# EasyEDA Pro project RemlaHAT.epro

# Schematic Atomic Spectra

## Sheets
1 Motors and Ambient Light: Create Date: 2024-02-16; Page Name: Motors and Ambient Light; Project Name: RemlaHAT; Schematic Name: Atomic Spectra; Update Date: 2024-02-16; Company: UCSB Physics Remla; Drawed: Barry Wang; Page Size: A4; Version: V0.1
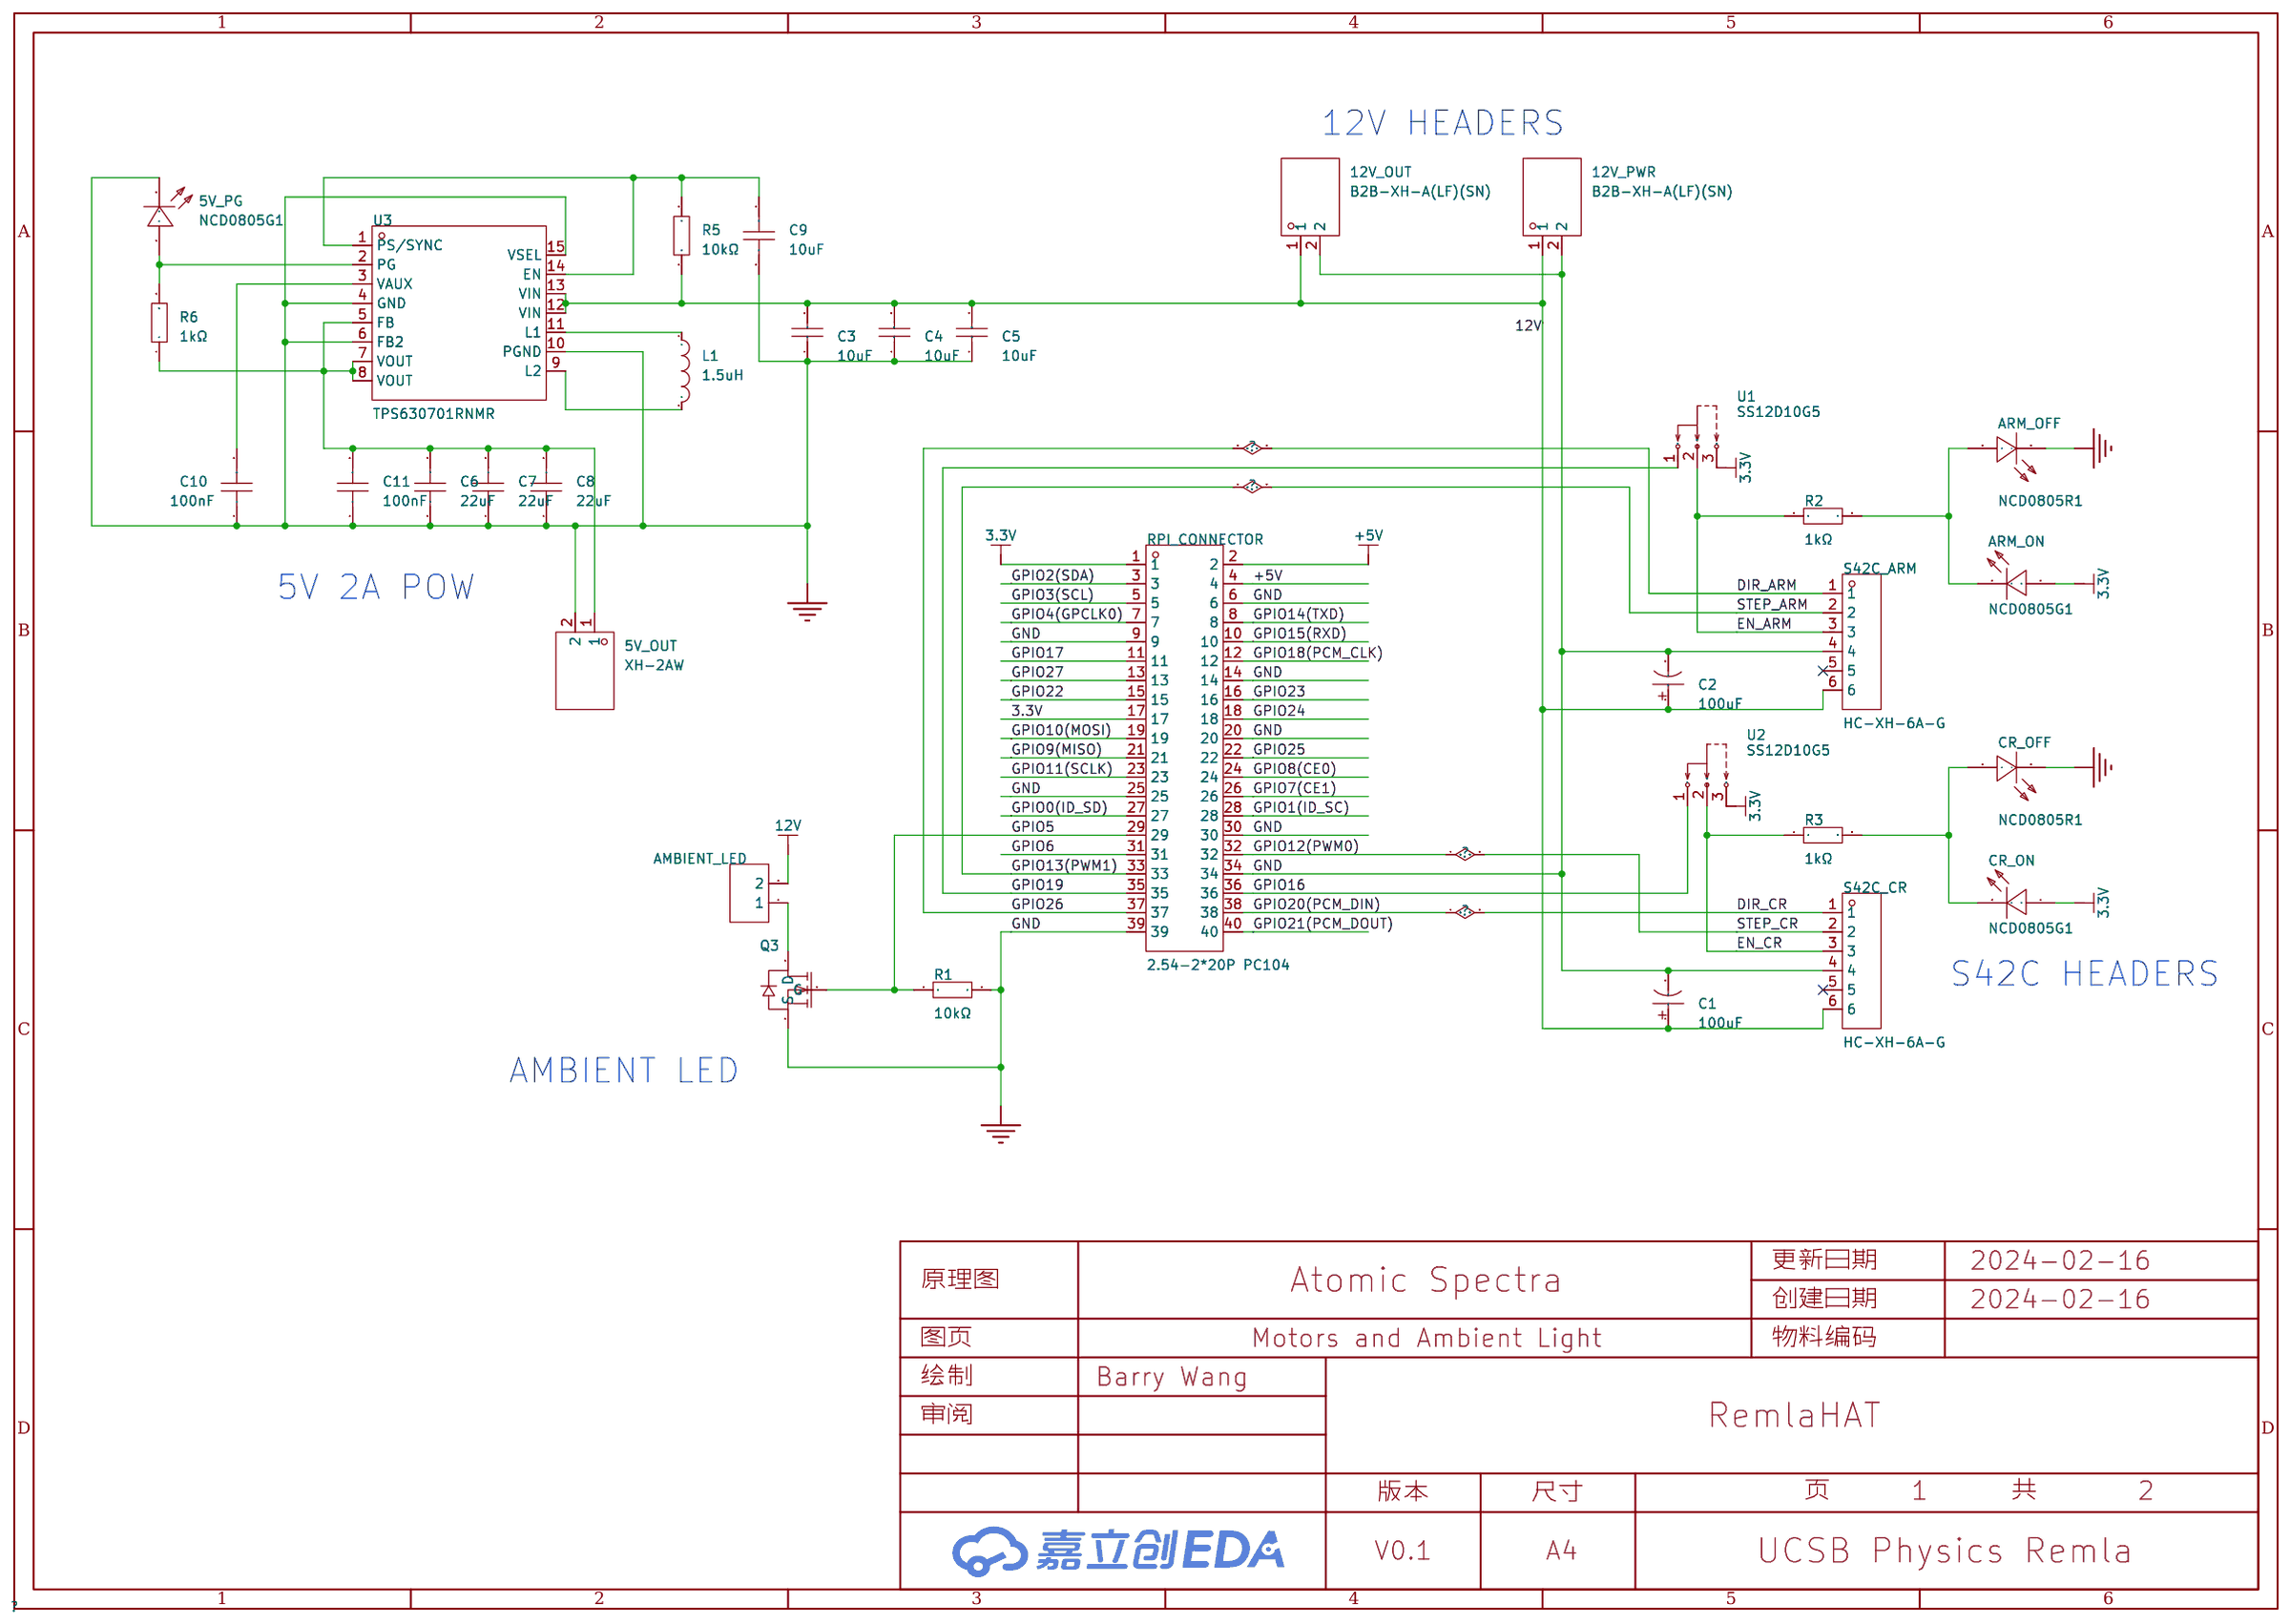
[diagram p0: Motors and Ambient Light]
2 Camera Connector: Page Name: Camera Connector; Company: 嘉立创EDA; Version: V1.0
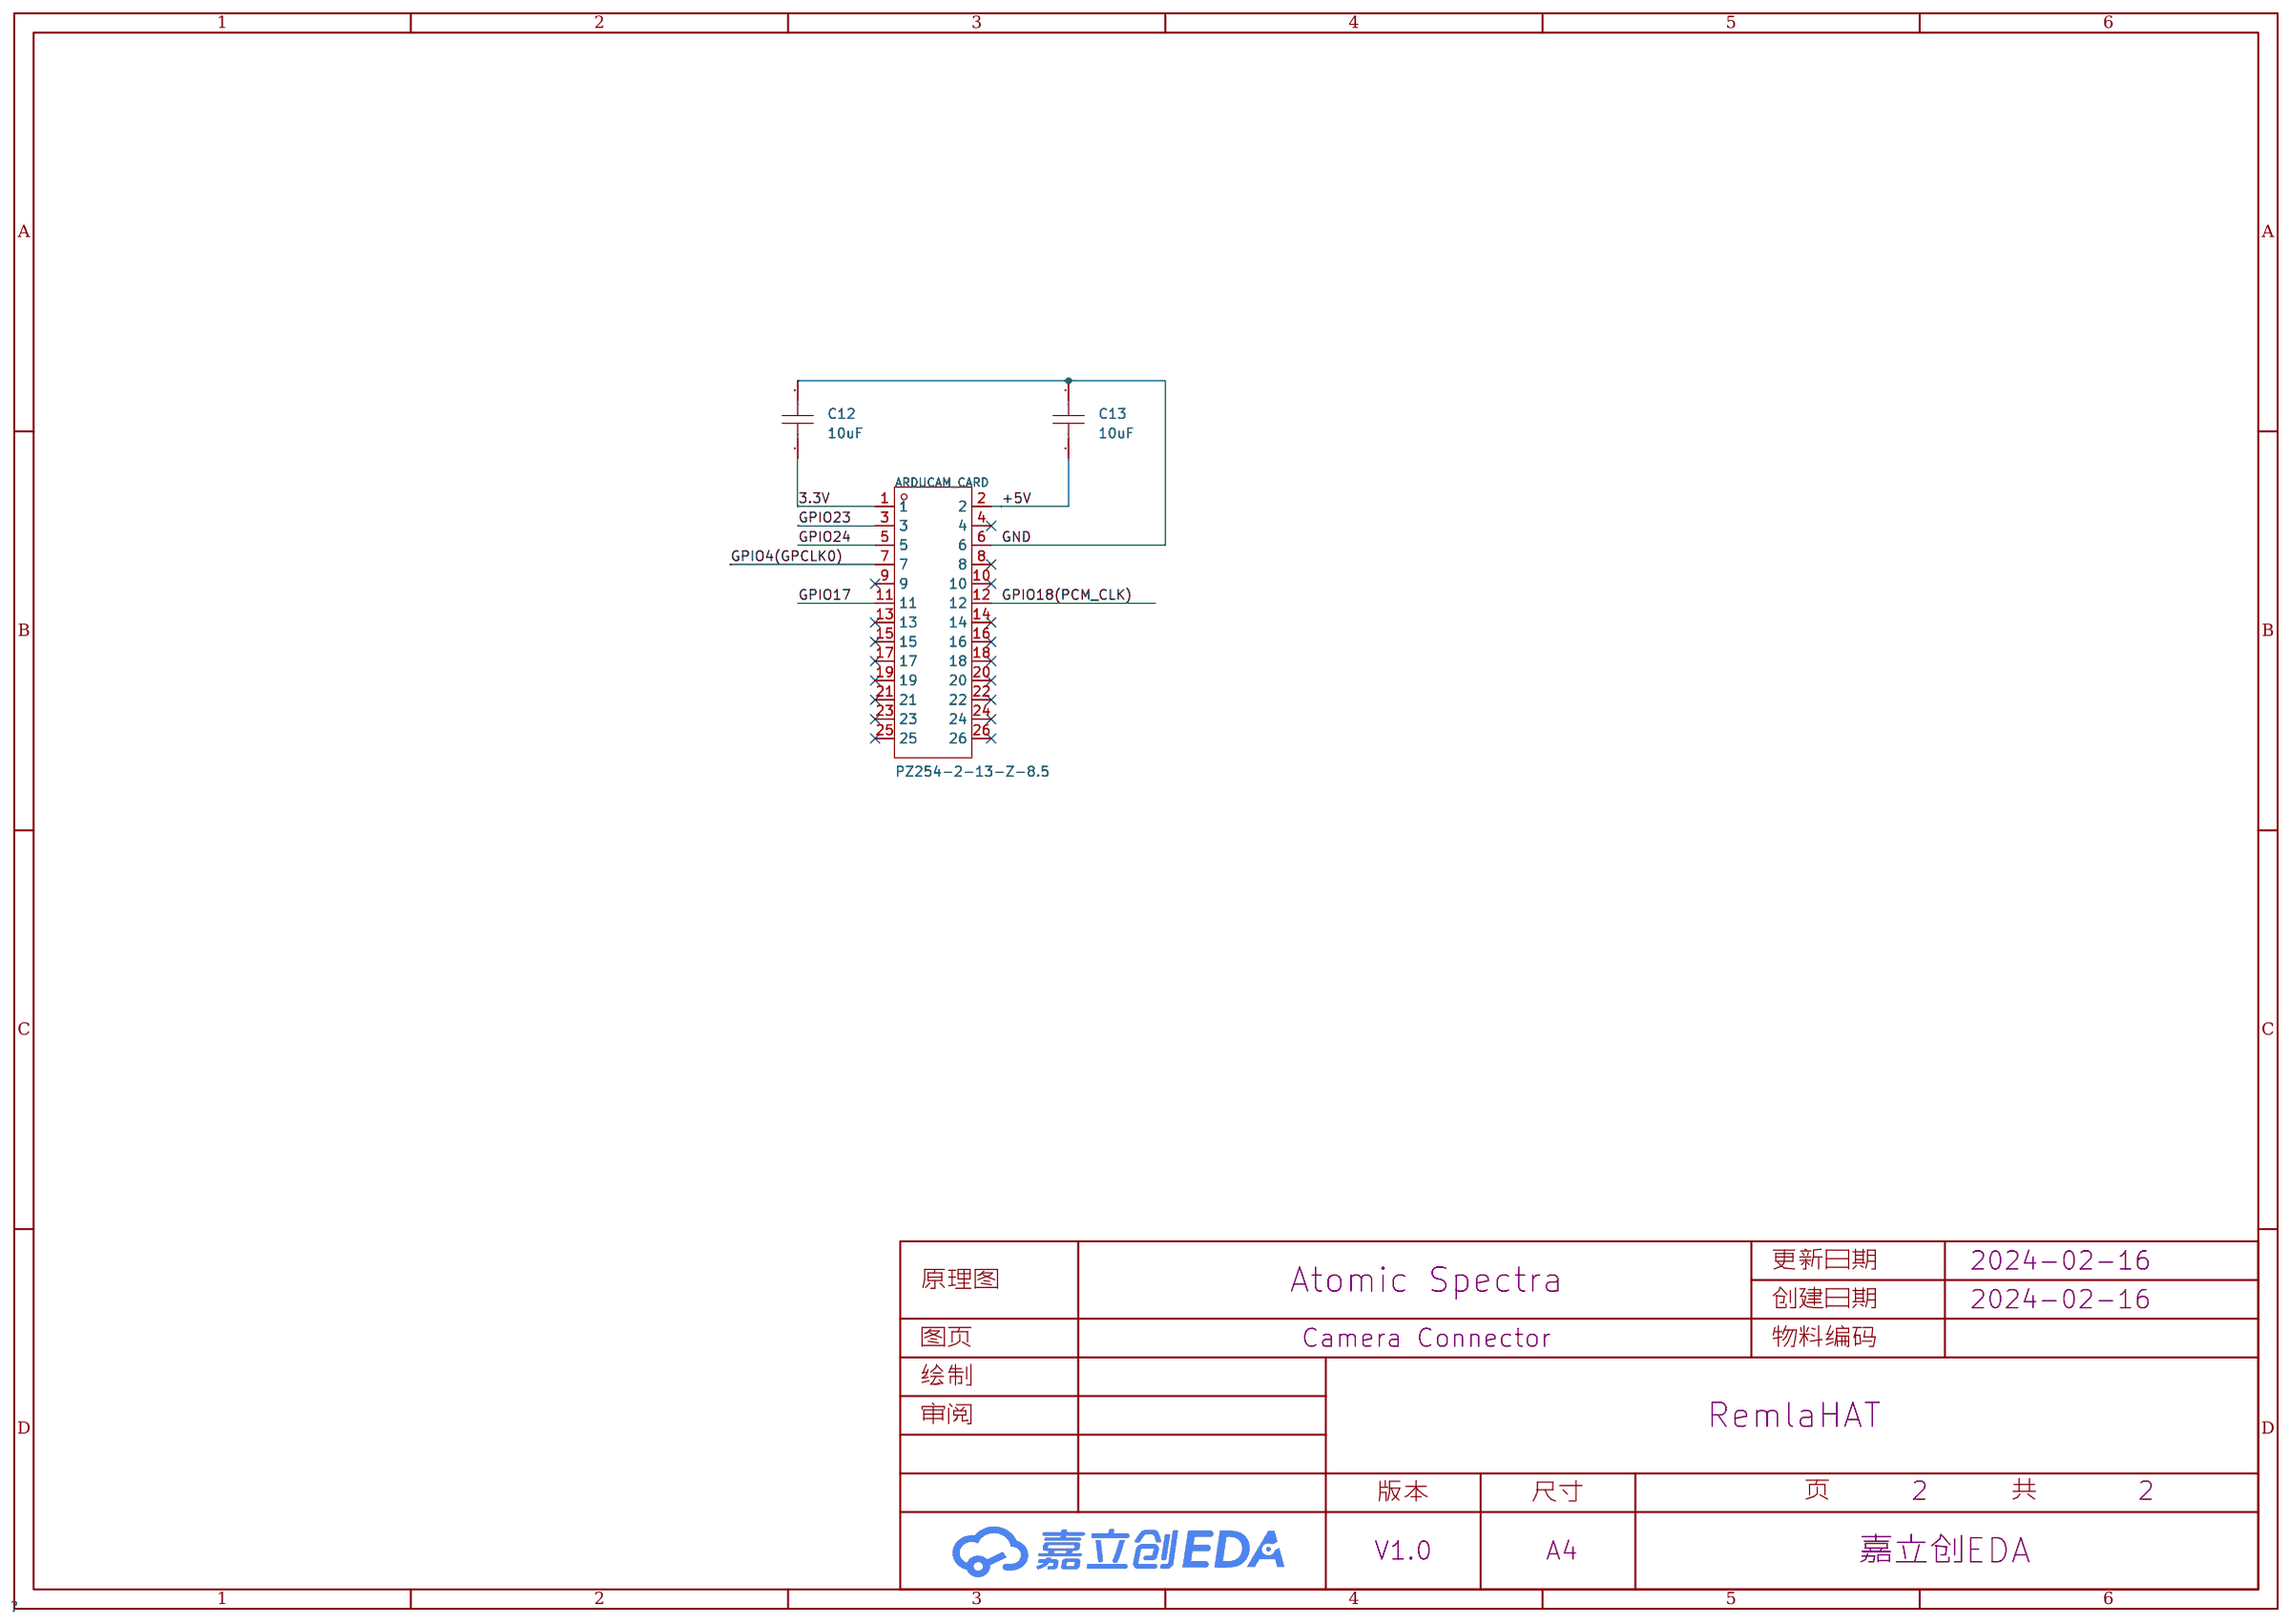
[diagram p1: Camera Connector]

## Parts
sheet Camera Connector
ARDUCAM_CARD  PZ254-2-13-Z-8.5  [HDR-TH_26P-P2.54-V-M-R2-C13-S2.54]
C12  10uF  [C0603]
C13  10uF  [C0603]
sheet Motors and Ambient Light
5V_OUT  XH-2AW  [CONN-TH_2P-P2.50_XH-2AW]
5V_PG  NCD0805G1  [LED0805-R-RD]
12V_OUT  B2B-XH-A(LF)(SN)  [CONN-TH_B2B-XH-A-LF-SN]
12V_PWR  B2B-XH-A(LF)(SN)  [CONN-TH_B2B-XH-A-LF-SN]
AMBIENT_LED  -  [HDR-TH_2P-P2.54-V-F]
ARM_OFF  NCD0805R1  [LED0805-R-RD]
ARM_ON  NCD0805G1  [LED0805-R-RD]
C1  100uF  [CAP-TH_BD5.0-P2.00-D0.8-FD]
C2  100uF  [CAP-TH_BD5.0-P2.00-D0.8-FD]
C3  10uF  [C0805]
C4  10uF  [C0805]
C5  10uF  [C0805]
C6  22uF  [C0805]
C7  22uF  [C0805]
C8  22uF  [C0805]
C9  10uF  [C0603]
C10  100nF  [C0402]
C11  100nF  [C0603]
CR_OFF  NCD0805R1  [LED0805-R-RD]
CR_ON  NCD0805G1  [LED0805-R-RD]
L1  1.5uH  [IND-SMD_L4.0-W4.0-A]
Q3  -  [SOT-23-3_L2.9-W1.3-P1.90-LS2.4-BR]
R1  10kΩ  [R0603]
R2  1kΩ  [R0603]
R3  1kΩ  [R0603]
R5  10kΩ  [R0603]
R6  1kΩ  [R0603]
RPI_CONNECTOR  2.54-2*20P PC104  [HDR-TH_40P-P2.54-V-F-R2-C20-S2.54-2]  (no BOM)
S42C_ARM  HC-XH-6A-G  [CONN-TH_6P-P2.50_HC-XH-6A-G]
S42C_CR  HC-XH-6A-G  [CONN-TH_6P-P2.50_HC-XH-6A-G]
U1  SS12D10G5  [SW-TH_SHOU-HAN_SS12D10G4]
U2  SS12D10G5  [SW-TH_SHOU-HAN_SS12D10G4]
U3  TPS630701RNMR  [VQFN-HR-15_L3.0-W2.5-P0.50-BL_TPS63070RNMR]

## Library data of the parts
ARDUCAM_CARD = PZ254-2-13-Z-8.5: 排数:双排;总PIN位数:26P;间距:2.54mm;插针结构:2x13P;行距:2.54mm;安装类型:直插;圆针/方针:方针;额定电流:3A;额定电压:-;配合针长度:6mm;塑高:2.5mm;端接针长度:3mm;触头材质:-;工作温度范围:-40℃~+105℃;颜色:黑色;; LCSC Part Name: 2.54mm 2x13P 直插 方针; Supplier Part: C2894974; Manufacturer: HCTL(华灿天禄); Supplier Footprint: 插件,P=2.54mm; JLCPCB Part Class: 扩展库; Datasheet: https://atta.szlcsc.com/upload/public/pdf/source/20230609/5BA09C8BEB9B31376F8BF6032FF67CAC.pdf; Supplier: LCSC; Number of Rows: 双排; Number of Pins: 26P; Pitch: 2.54mm; Pin Structure: 2x13P; Row Spacing: 2.54mm; Mounting Type: 直插; Circluar Pins/Square Pins: 方针; Current Rating (Max): 3A; Length of Mating Pin: 6mm; Insulation Height: 2.5mm; Length of End Connection Pin: 3mm; Operating Temperature Range: -40℃~+105℃; Color: 黑色
C9 C12 C13 = CL10A106KP8NNNC: 容值:10uF;精度:±10%;额定电压:10V;材质(温度系数):X5R;; LCSC Part Name: 10uF ±10% 10V; Supplier Part: C19702; Manufacturer: SAMSUNG(三星); Supplier Footprint: 0603; JLCPCB Part Class: 基础库; Datasheet: https://atta.szlcsc.com/upload/public/pdf/source/20160218/1457707763339.pdf; Supplier: LCSC; Tolerance: ±10%; Voltage Rated: 10V; Temperature Coefficient: X5R
5V_OUT = XH-2AW_C33132: 插针结构:1x2P;间距:2.5mm;安装方式:弯插;参考系列:XH;总PIN数:2P;排数:1;每排PIN数:2;行距:-;触头材质:磷青铜;; LCSC Part Name: 系列:XH 间距:2.5mm 1x2P; Supplier Part: C33132; Manufacturer: BOOMELE(博穆精密); Supplier Footprint: 弯插,P=2.5mm; JLCPCB Part Class: Extended Part; Datasheet: https://atta.szlcsc.com/upload/public/pdf/source/20151222/1457707654251.pdf; Supplier: LCSC; Pins Structure: 1x2P; Pitch: 2.5mm; Mounting Style: 弯插; Reference Series: XH; Number of Pins: 2P; Number of Rows: 1; Number of PINs Per Row: 2; Contact Material: 磷青铜
5V_PG ARM_ON CR_ON = NCD0805G1: 发光颜色:翠绿色;正向电压(VF):2.5V~3.6V;功率:72mW;正向电流:5mA;主波长:525nm~537.5nm;透镜颜色:无色透明透镜;发光强度:180mcd~400mcd;发光角度:130°;工作温度:-30℃~+85℃;; Supplier Part: C84260; Manufacturer: 国星光电; Supplier Footprint: 0805; JLCPCB Part Class: 扩展库; Datasheet: https://atta.szlcsc.com/upload/public/pdf/source/20200820/C84260_AFC7BF57C6FBA034D182BB8D10A67EFE.pdf; Supplier: LCSC; Emitted Color: 翠绿色; Forward Voltage (VF): 2.5V~3.6V; Power Dissipation: 72mW; Forward Current: 5mA; Dominant Wavelength: 525nm~537.5nm; Lens Color: 无色透明透镜; Luminous Intensity: 180mcd~400mcd; Viewing Angle: 130°; Operating Temperature: -30℃~+85℃
12V_OUT 12V_PWR = B2B-XH-A(LF)(SN): 插针结构:1x2P;间距:2.5mm;安装方式:-;行距:-;总PIN数:2P;排数:1;每排PIN数:2;参考系列:XH;触头材质:黄铜;; LCSC Part Name: 1x2P 间距:2.5mm 系列:XH; Supplier Part: C158012; Manufacturer: JST; Supplier Footprint: 插件,P=2.5mm; JLCPCB Part Class: 扩展库; Datasheet: https://atta.szlcsc.com/upload/public/pdf/source/20180928/C265283_F9DFEEBDB2CF642B6BDFAB4B77BD2680.pdf; Supplier: LCSC; Pins Structure: 1x2P; Pitch: 2.5mm; Number of Pins: 2P; Number of Rows: 1; Number of PINs Per Row: 2; Reference Series: XH; Contact Material: 黄铜
AMBIENT_LED = HDR-F_2.54_1x2P: Supplier Part: C49661; Supplier Footprint: 插件
ARM_OFF CR_OFF = NCD0805R1: 灯头类型:-;发光颜色:红色;正向电压(VF):1.6V~2.6V;功率:65mW;正向电流:20mA;主波长:615nm~630nm;二极管配置:独立二极管;透镜颜色:无色透明;色温:-;发光强度:67mcd~195mcd;发光角度:130°;载带方式:-;工作温度:-30℃~+85℃;; Supplier Part: C84256; Manufacturer: 国星光电; Supplier Footprint: 0805; JLCPCB Part Class: 基础库; Datasheet: https://atta.szlcsc.com/upload/public/pdf/source/20200820/C84256_F0A75A43B3EAD75808600A0514C76B99.pdf; Supplier: LCSC; Emitted Color: 红色; Forward Voltage (VF): 1.6V~2.6V; Power Dissipation: 65mW; Forward Current: 20mA; Dominant Wavelength: 615nm~630nm; Diode Configuration: 独立二极管; Lens Color: 无色透明; Luminous Intensity: 67mcd~195mcd; Viewing Angle: 130°; Operating Temperature: -30℃~+85℃
C1 C2 = KS107M016D07RR0VH2FP0: 容值:100uF;精度:±20%;额定电压:16V;纹波电流:-;等效串联电阻:-;; LCSC Part Name: 100uF ±20% 16V; Supplier Part: C43803; Manufacturer: CX(承兴); Supplier Footprint: 插件,D5xL7mm; JLCPCB Part Class: 扩展库; Datasheet: https://atta.szlcsc.com/upload/public/pdf/source/20230817/0DB19D47181DB7F2222DAA6444591EF5.pdf; Supplier: LCSC; Tolerance: ±20%; Rated Voltage: 16V; φD: 5mm; L: 7mm; Lead Spacing: 2mm; Lifetime @ Temp: 1000hrs@105℃
C3-C5 = CL21A106KOQNNNE: 容值:10uF;精度:±10%;额定电压:16V;材质(温度系数):X5R;; LCSC Part Name: 10uF ±10% 16V; Supplier Part: C1713; Manufacturer: SAMSUNG(三星); Supplier Footprint: 0805; JLCPCB Part Class: 扩展库; Datasheet: https://atta.szlcsc.com/upload/public/pdf/source/20160218/1457707763339.pdf; Supplier: LCSC; Tolerance: ±10%; Voltage Rated: 16V; Temperature Coefficient: X5R
C6-C8 = CL21A226MAQNNNE_C45783: 容值:22uF;精度:±20%;额定电压:25V;材质(温度系数):X5R;; LCSC Part Name: 22uF ±20% 25V; Supplier Part: C45783; Manufacturer: SAMSUNG(三星); Manufacturer Part: CL21A226MAQNNNE; Supplier Footprint: 0805; JLCPCB Part Class: 基础库; Datasheet: https://atta.szlcsc.com/upload/public/pdf/source/20160218/1457707763339.pdf; Supplier: LCSC; Tolerance: ±20%; Voltage Rated: 25V; Temperature Coefficient: X5R
C10 = CC0402KRX7R7BB104: 容值:100nF;精度:±10%;额定电压:16V;材质(温度系数):X7R;; LCSC Part Name: 100nF ±10% 16V; Supplier Part: C60474; Manufacturer: YAGEO(国巨); Supplier Footprint: 0402; JLCPCB Part Class: 扩展库; Datasheet: https://atta.szlcsc.com/upload/public/pdf/source/20211223/9278FD768280B81DDBEF48FA36411A03.pdf; Supplier: LCSC; Tolerance: ±10%; Voltage Rated: 16V; Temperature Coefficient: X7R
C11 = CC0603KRX7R9BB104: 容值:100nF;精度:±10%;额定电压:50V;材质(温度系数):X7R;; LCSC Part Name: 100nF ±10% 50V; Supplier Part: C14663; Manufacturer: YAGEO(国巨); Supplier Footprint: 0603; JLCPCB Part Class: 基础库; Datasheet: https://atta.szlcsc.com/upload/public/pdf/source/20180910/C282072_33301C7F631E79921B82A8DAC6BCC5B3.pdf; Supplier: LCSC; Tolerance: ±10%; Voltage Rated: 50V; Temperature Coefficient: X7R
L1 = XFL4020-152MEC: 电感值:1.5uH;精度:±20%;额定电流:-;类型:-;饱和电流(Isat):-;; LCSC Part Name: 1.5uH ±20%; Supplier Part: C3033018; Manufacturer: Coilcraft(线艺); Supplier Footprint: SMD,4x4mm; JLCPCB Part Class: 扩展库; Datasheet: https://atta.szlcsc.com/upload/public/pdf/source/20220606/2F3F6B3731D30DFC0E7308BCF15AD72A.pdf; Supplier: LCSC; Tolerance: ±20%
Q3 = AO3400A_N: 类型:N沟道;漏源电压(Vdss):30V;连续漏极电流(Id):5.2A;功率(Pd):1W;导通电阻(RDS(on)@Vgs,Id):35mΩ@10V,5A;阈值电压(Vgs(th)@Id):1.5V@250μA;; Supplier Footprint: SOT-23; Supplier Part: C700953
R1 R5 = 0603WAF1002T5E: 电阻类型:厚膜电阻;阻值:10kΩ;精度:±1%;功率:100mW;最大工作电压:75V;温度系数:±100ppm/℃;; LCSC Part Name: 10kΩ ±1% 100mW 厚膜电阻; Supplier Part: C25804; Manufacturer: UNI-ROYAL(厚声); Supplier Footprint: 0603; JLCPCB Part Class: Basic Part; Datasheet: https://atta.szlcsc.com/upload/public/pdf/source/20200306/C422600_1E6D84923E4A46A82E41ADD87F860B5C.pdf; Supplier: LCSC; Type: 厚膜电阻; Tolerance: ±1%; Power(Watts): 100mW; Overload Voltage (Max): 75V; Temperature Coefficient: ±100ppm/℃; Operating Temperature Range: -55℃~+155℃
R2 R3 R6 = 0603WAF1001T5E: 阻值:1kΩ;精度:±1%;功率:100mW;温度系数:±100ppm/℃;电阻类型:厚膜电阻;; LCSC Part Name: 1kΩ ±1% 100mW 厚膜电阻; Supplier Part: C21190; Manufacturer: UNI-ROYAL(厚声); Supplier Footprint: 0603; JLCPCB Part Class: Basic Part; Datasheet: https://atta.szlcsc.com/upload/public/pdf/source/20200306/C422600_1E6D84923E4A46A82E41ADD87F860B5C.pdf; Supplier: LCSC; Tolerance: ±1%; Power(Watts): 100mW; Overload Voltage (Max): 75V; Temperature Coefficient: ±100ppm/℃; Type: 厚膜电阻; Operating Temperature Range: -55℃~+155℃
RPI_CONNECTOR = 2.54-2*20P母长PC104: 排数:双排;总孔位数:40P;间距:2.54mm;插孔结构:2x20P;行距:2.54mm;安装类型:直插;塑高:-;触头材质:黄铜;触头镀层:-;; LCSC Part Name: 间距:2.54mm 2x20P 直插; Supplier Part: C35165; Manufacturer: BOOMELE(博穆精密); Supplier Footprint: 插件,P=2.54mm; JLCPCB Part Class: 扩展库; Datasheet: https://atta.szlcsc.com/upload/public/pdf/source/20151109/1457707557259.pdf; Supplier: LCSC; Number of Rows: 双排; Number of Holes: 40P; Pitch: 2.54mm; Holes Structure: 2x20P; Row Spacing: 2.54mm; Mounting Type: 直插; Contact Material: 黄铜
S42C_ARM S42C_CR = HC-XH-6A-G: 插针结构:1x6P;间距:2.54mm;安装方式:直插;参考系列:XH;总PIN数:6P;排数:1;每排PIN数:6;行距:2.54mm;额定电流:3A;触头材质:黄铜;触头镀层:锡;工作温度范围:-25℃~+85℃;; Supplier Part: C5341205; Manufacturer: HCTL(华灿天禄); Supplier Footprint: 插件,P=2.5mm; JLCPCB Part Class: Extended Part; Datasheet: https://atta.szlcsc.com/upload/public/pdf/source/20230711/68D365716984B4AFE576D1D73D61B465.pdf; Supplier: LCSC; Pins Structure: 1x6P; Pitch: 2.54mm; Mounting Style: 直插; Reference Series: XH; Number of Pins: 6P; Number of Rows: 1; Number of PINs Per Row: 6; Row Spacing: 2.54mm; Current Rating (Max): 3A; Contact Material: 黄铜; Contact Plating: 锡; Operating Temperature Range: -25℃~+85℃
U1 U2 = SS12D10G5: LCSC Part Name: 两档立式插件 3脚拨动开关 柄长5.0mm; Supplier Part: C7431054; Manufacturer: SHOU HAN(首韩); Supplier Footprint: 插件; JLCPCB Part Class: 扩展库; Datasheet: https://atta.szlcsc.com/upload/public/pdf/source/20231130/7A3DB6A149BF0A1DCFFE64FFC07FE434.pdf; Supplier: LCSC
U3 = TPS630701RNMR: Supplier Part: C2876599; Manufacturer: TI(德州仪器); Supplier Footprint: VQFN-15-HR(2.5x3); JLCPCB Part Class: 扩展库; Datasheet: https://www.ti.com/cn/lit/gpn/tps63070; Supplier: LCSC

## Nets
3.3V: ARDUCAM_CARD.1 ARM_ON.1(A) C12.1 CR_ON.1(A) RPI_CONNECTOR.1 RPI_CONNECTOR.17 U1.3 U2.3
12V: 12V_OUT.1 12V_PWR.1 AMBIENT_LED.2 C1.1 C2.1 C3.2 C4.2 C5.2 R5.1 S42C_ARM.6 S42C_CR.6 U3.12(VIN) U3.13(VIN)
+5V: ARDUCAM_CARD.2 C13.1 RPI_CONNECTOR.2 RPI_CONNECTOR.4
GND: 5V_OUT.2 5V_PG.2(K) 12V_OUT.2 12V_PWR.2 ARDUCAM_CARD.6 ARM_OFF.2(-) C1.2 C2.2 C3.1 C4.1 C5.1 C6.1 C7.1 C8.1 C9.2 C10.1 C11.1 C12.2 C13.2 CR_OFF.2(-) Q3.2(S) R1.2 RPI_CONNECTOR.6 RPI_CONNECTOR.9 RPI_CONNECTOR.14 RPI_CONNECTOR.20 RPI_CONNECTOR.25 RPI_CONNECTOR.30 RPI_CONNECTOR.34 RPI_CONNECTOR.39 S42C_ARM.4 S42C_CR.4 U3.4(GND) U3.6(FB2) U3.10(PGND) U3.15(VSEL)
DIR_ARM: RPI_CONNECTOR.37 S42C_ARM.1
DIR_CR: RPI_CONNECTOR.38 S42C_CR.1
EN_ARM: R2.1 S42C_ARM.3 U1.2
EN_CR: R3.1 S42C_CR.3 U2.2
GPIO0(ID_SD): RPI_CONNECTOR.27
GPIO1(ID_SC): RPI_CONNECTOR.28
GPIO2(SDA): RPI_CONNECTOR.3
GPIO3(SCL): RPI_CONNECTOR.5
GPIO4(GPCLK0): ARDUCAM_CARD.7 RPI_CONNECTOR.7
GPIO5: Q3.1(G) R1.1 RPI_CONNECTOR.29
GPIO6: RPI_CONNECTOR.31
GPIO7(CE1): RPI_CONNECTOR.26
GPIO8(CE0): RPI_CONNECTOR.24
GPIO9(MISO): RPI_CONNECTOR.21
GPIO10(MOSI): RPI_CONNECTOR.19
GPIO11(SCLK): RPI_CONNECTOR.23
GPIO12(PWM0): RPI_CONNECTOR.32 S42C_CR.2
GPIO13(PWM1): RPI_CONNECTOR.33 S42C_ARM.2
GPIO14(TXD): RPI_CONNECTOR.8
GPIO15(RXD): RPI_CONNECTOR.10
GPIO16: RPI_CONNECTOR.36 U2.1
GPIO17: ARDUCAM_CARD.11 RPI_CONNECTOR.11
GPIO18(PCM_CLK): ARDUCAM_CARD.12 RPI_CONNECTOR.12
GPIO19: RPI_CONNECTOR.35 U1.1
GPIO21(PCM_DOUT): RPI_CONNECTOR.40
GPIO22: RPI_CONNECTOR.15
GPIO23: ARDUCAM_CARD.3 RPI_CONNECTOR.16
GPIO24: ARDUCAM_CARD.5 RPI_CONNECTOR.18
GPIO25: RPI_CONNECTOR.22
GPIO27: RPI_CONNECTOR.13
$2N1921: AMBIENT_LED.1 Q3.3(D)
$2N9076: L1.1 U3.11(L1)
$2N9079: L1.2 U3.9(L2)
$2N9546: 5V_PG.1(A) R6.2 U3.2(PG)
$2N9638: 5V_OUT.1 C6.2 C7.2 C8.2 C11.2 R6.1 U3.5(FB) U3.7(VOUT) U3.8(VOUT)
$2N9881: C9.1 R5.2 U3.1(PS/SYNC) U3.14(EN)
$2N10294: C10.2 U3.3(VAUX)
$2N13933: ARM_OFF.1(+) ARM_ON.2(K) R2.2
$2N14161: CR_OFF.1(+) CR_ON.2(K) R3.2

Not connected (* = marked no-connect by the designer): ARDUCAM_CARD 4* 8* 9* 10* 13* 14* 15* 16* 17* 18* 19* 20* 21* 22* 23* 24* 25* 26*; S42C_ARM 5*; S42C_CR 5*

## Notes on the sheets
sheet 1
- 12V HEADERS
- 5V 2A POW
- S42C HEADERS
- AMBIENT LED

# Board Remla Atomic HAT PCB
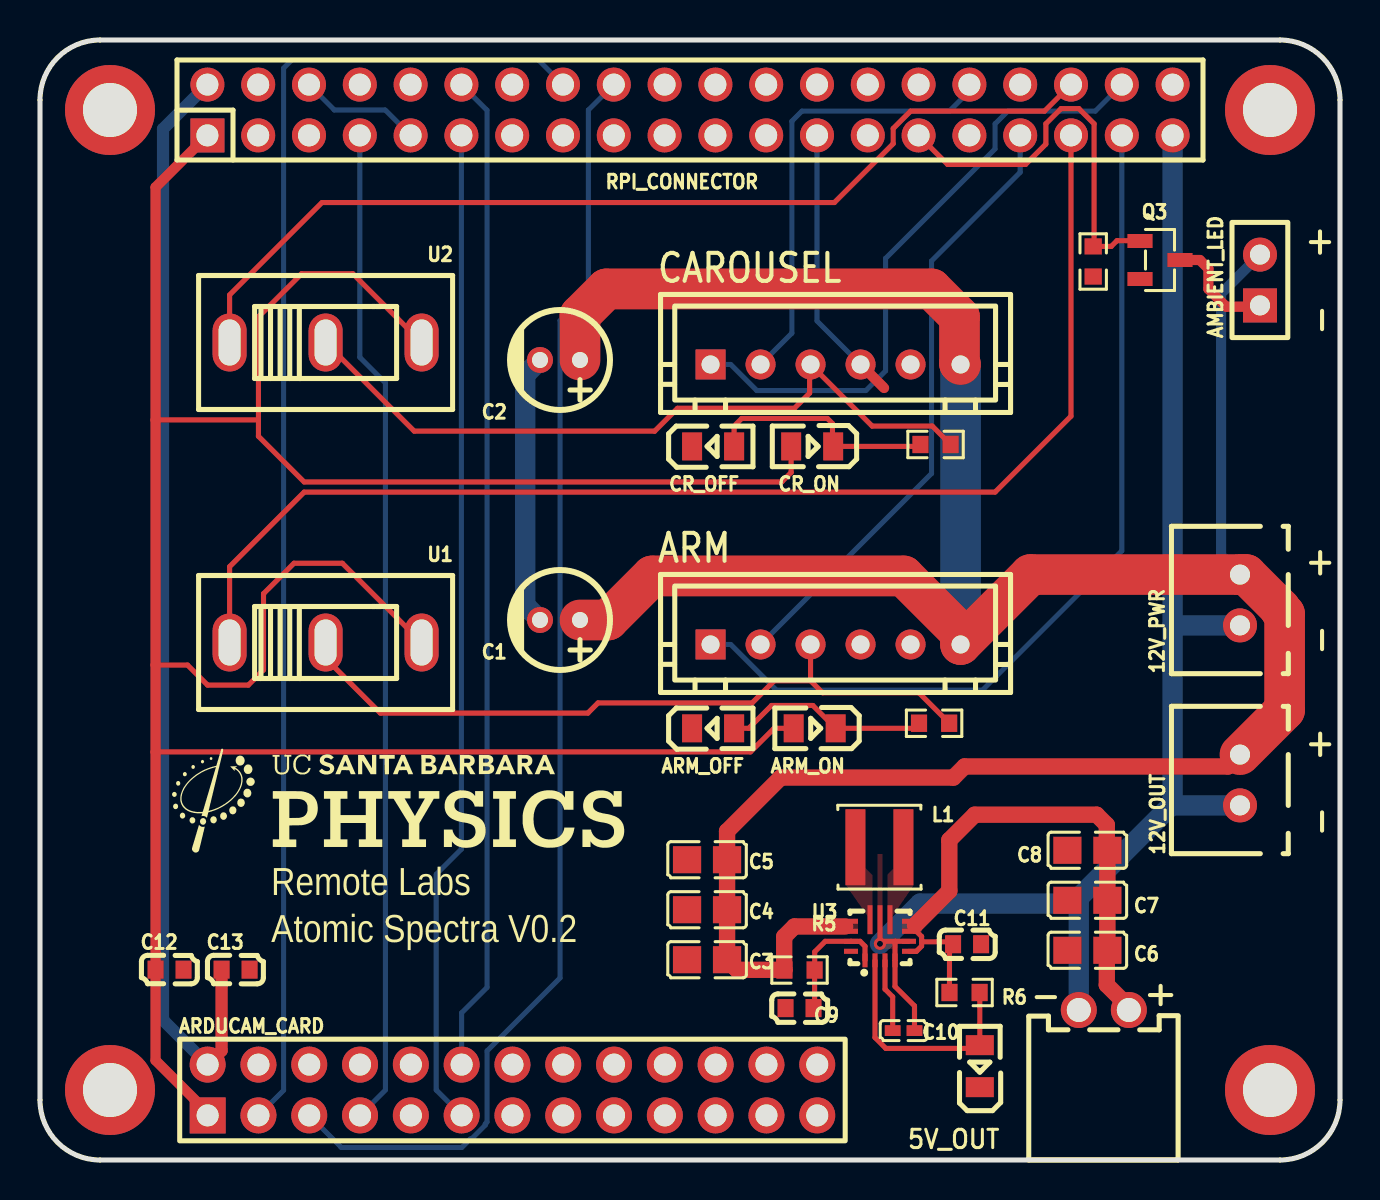
[diagram p2: board, top side]
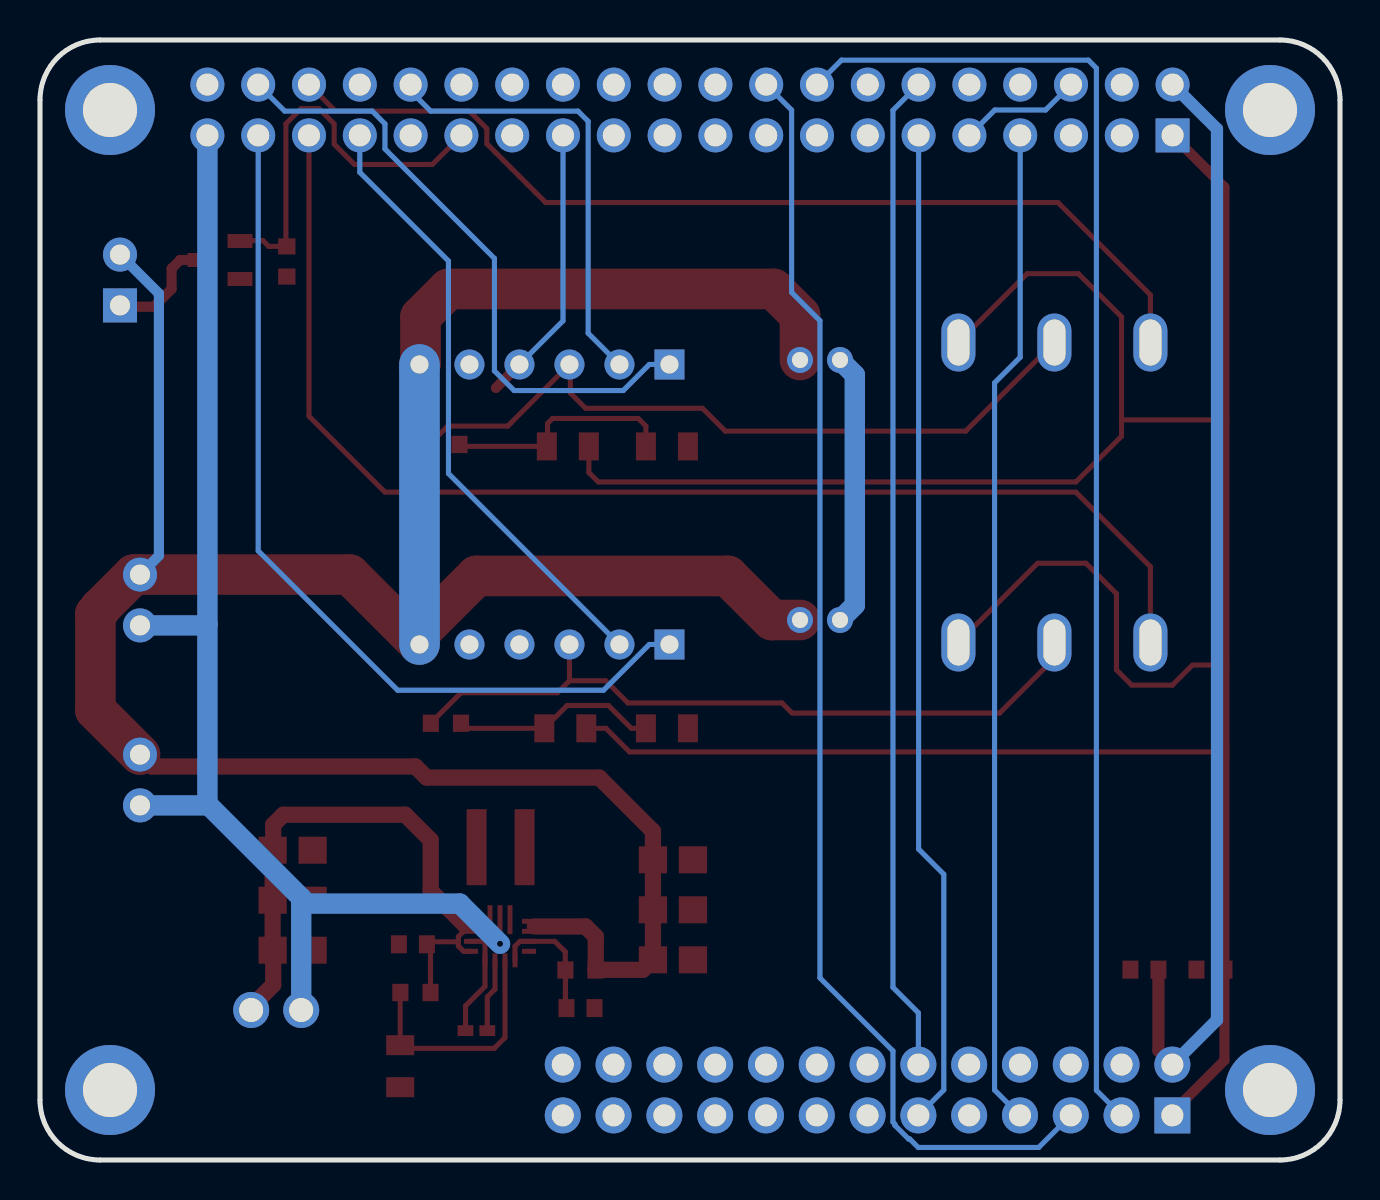
[diagram p3: board, bottom side, seen from below]

Outline 65 x 56 mm; copper layers: Top Layer, Bottom Layer. Coordinates in mm from the lower left corner of the outline.
Outline path: 0,53 0,3 arc(0.88,0.88) 3,0 62,0 arc(64.12,0.88) 65,3 65,53 arc(64.12,55.12) 62,56 3,56 arc(0.88,55.12) 0,53
Stack: Top Layer 0.035mm / Dielectric1 1.51mm FR4 er 4.5 / Bottom Layer 0.035mm

## Design rules (mm)
template: 自定义配置
spacing copperThickness1oz (default): track to track 0.102, other pairs 0.152 to 0.3
spacing copperThickness2oz: track to track 0.203, other pairs 0.152 to 0.3
track width copperThickness1oz (default): min 0.127, default 0.254, max 2.54
track width copperThickness2oz: min 0.127, default 0.254, max 2.54
differential pair differentialPair (default): width min 0.127, default 0.254, max 2.54; gap min 0.152, default 0.152
via viaSize (default): diameter min 0.5, default 0.61, max 10; hole min 0.3, default 0.305, max 6.299

## Placement (name value [footprint] x y rotation side)
5V_OUT  XH-2AW  [CONN-TH_2P-P2.50_XH-2AW]  53.19 7.5 180 top
5V_PG  NCD0805G1  [LED0805-R-RD]  46.99 4.69 90 top
12V_OUT  B2B-XH-A(LF)(SN)  [CONN-TH_B2B-XH-A-LF-SN]  60 19 90 top
12V_PWR  B2B-XH-A(LF)(SN)  [CONN-TH_B2B-XH-A-LF-SN]  60 28 90 top
AMBIENT_LED  -  [HDR-TH_2P-P2.54-V-F]  61 44 90 top
ARDUCAM_CARD  PZ254-2-13-Z-8.5  [HDR-TH_26P-P2.54-V-M-R2-C13-S2.54]  23.62 3.5 0 top
ARM_OFF  NCD0805R1  [LED0805-R-RD]  33.66 21.58 0 top
ARM_ON  NCD0805G1  [LED0805-R-RD]  38.74 21.58 180 top
C1  100uF  [CAP-TH_BD5.0-P2.00-D0.8-FD]  26 27 180 top
C2  100uF  [CAP-TH_BD5.0-P2.00-D0.8-FD]  26 40 180 top
C3  10uF  [C0805]  33.35 10.01 0 top
C4  10uF  [C0805]  33.35 12.51 0 top
C5  10uF  [C0805]  33.35 15.01 0 top
C6  22uF  [C0805]  52.37 10.49 0 top
C7  22uF  [C0805]  52.37 12.99 0 top
C8  22uF  [C0805]  52.37 15.49 0 top
C9  10uF  [C0603]  37.98 7.59 180 top
C10  100nF  [C0402]  43.18 6.47 180 top
C11  100nF  [C0603]  46.35 10.79 180 top
C12  10uF  [C0603]  6.48 9.52 0 top
C13  10uF  [C0603]  9.78 9.52 0 top
CR_OFF  NCD0805R1  [LED0805-R-RD]  33.66 35.68 0 top
CR_ON  NCD0805G1  [LED0805-R-RD]  38.61 35.68 180 top
L1  1.5uH  [IND-SMD_L4.0-W4.0-A]  41.97 15.64 0 top
NOREF  -  [Pad_e15]  3.5 52.5 0 top
NOREF#2  -  [Pad_e19]  61.5 3.5 0 top
NOREF#3  -  [Pad_e17]  61.5 52.5 0 top
NOREF#4  -  [Pad_e18]  3.5 3.5 0 top
Q3  -  [SOT-23-3_L2.9-W1.3-P1.90-LS2.4-BR]  56 45 180 top
R1  10kΩ  [R0603]  52.66 44.93 270 top
R2  1kΩ  [R0603]  44.7 21.84 180 top
R3  1kΩ  [R0603]  44.78 35.78 180 top
R5  10kΩ  [R0603]  37.98 9.5 0 top
R6  1kΩ  [R0603]  46.23 8.38 0 top
RPI_CONNECTOR  2.54-2*20P PC104  [HDR-TH_40P-P2.54-V-F-R2-C20-S2.54-2]  32.5 52.5 0 top
S42C_ARM  HC-XH-6A-G  [CONN-TH_6P-P2.50_HC-XH-6A-G]  39.78 25.78 0 top
S42C_CR  HC-XH-6A-G  [CONN-TH_6P-P2.50_HC-XH-6A-G]  39.78 39.78 0 top
U1  SS12D10G5  [SW-TH_SHOU-HAN_SS12D10G4]  14.28 25.88 0 top
U2  SS12D10G5  [SW-TH_SHOU-HAN_SS12D10G4]  14.28 40.88 0 top
U3  TPS630701RNMR  [VQFN-HR-15_L3.0-W2.5-P0.50-BL_TPS63070RNMR]  42 11 0 top

## Footprints (pads in the part's own frame, mm; a bottom-side part is the same pattern mirrored in y, then rotated)
C0402
  rect 0.79x0.54 smd: 1(-0.545,0) 2(0.545,0)
C0603
  rect 0.8x0.9 smd: 1(-0.7,0) 2(0.7,0)
C0805
  rect 1.41x1.35 smd: 1(-1,0) 2(1,0)
CAP-TH_BD5.0-P2.00-D0.8-FD
  round 1.3 hole 0.8: 1(-1,0) 2(1,0)
CONN-TH_2P-P2.50_XH-2AW
  round 1.8 hole 1.199: 1(-1.251,0) 2(1.251,0)
CONN-TH_6P-P2.50_HC-XH-6A-G
  rect 1.5x1.5 hole 0.9: 1(-6.25,0)
  round 1.5 hole 0.9: 2(-3.75,0) 3(-1.25,0) 4(1.25,0) 5(3.75,0) 6(6.25,0)
CONN-TH_B2B-XH-A-LF-SN
  round 1.7 hole 1: 1(1.27,0) 2(-1.27,0)
HDR-TH_2P-P2.54-V-F
  rect 1.7x1.7 hole 1: 1(-1.27,0)
  round 1.7 hole 1: 2(1.27,0)
HDR-TH_26P-P2.54-V-M-R2-C13-S2.54
  rect 1.8x1.8 hole 1.1: 1(-15.24,-1.27)
  round 1.8 hole 1.1: 2(-15.24,1.27) 3(-12.7,-1.27) 4(-12.7,1.27) 5(-10.16,-1.27) 6(-10.16,1.27) 7(-7.62,-1.27) 8(-7.62,1.27) 9(-5.08,-1.27) 10(-5.08,1.27) 11(-2.54,-1.27) 12(-2.54,1.27) 13(0,-1.27) 14(0,1.27) 15(2.54,-1.27) 16(2.54,1.27) 17(5.08,-1.27) 18(5.08,1.27) 19(7.62,-1.27) 20(7.62,1.27) 21(10.16,-1.27) 22(10.16,1.27) 23(12.7,-1.27) 24(12.7,1.27) 25(15.24,-1.27) 26(15.24,1.27)
HDR-TH_40P-P2.54-V-F-R2-C20-S2.54-2
  rect 1.7x1.7 hole 1.1: 1(-24.13,-1.27)
  round 1.7 hole 1.1: 2(-24.13,1.27) 3(-21.59,-1.27) 4(-21.59,1.27) 5(-19.05,-1.27) 6(-19.05,1.27) 7(-16.51,-1.27) 8(-16.51,1.27) 9(-13.97,-1.27) 10(-13.97,1.27) 11(-11.43,-1.27) 12(-11.43,1.27) 13(-8.89,-1.27) 14(-8.89,1.27) 15(-6.35,-1.27) 16(-6.35,1.27) 17(-3.81,-1.27) 18(-3.81,1.27) 19(-1.27,-1.27) 20(-1.27,1.27) 21(1.27,-1.27) 22(1.27,1.27) 23(3.81,-1.27) 24(3.81,1.27) 25(6.35,-1.27) 26(6.35,1.27) 27(8.89,-1.27) 28(8.89,1.27) 29(11.43,-1.27) 30(11.43,1.27) 31(13.97,-1.27) 32(13.97,1.27) 33(16.51,-1.27) 34(16.51,1.27) 35(19.05,-1.27) 36(19.05,1.27) 37(21.59,-1.27) 38(21.59,1.27) 39(24.13,-1.27) 40(24.13,1.27)
IND-SMD_L4.0-W4.0-A
  rect 1x3.8 smd: 1(-1.2,0) 2(1.2,0)
LED0805-R-RD
  rect 1x1.399 smd: 1(1.05,0) 2(-1.05,0)
Pad_e15
  round 4.5 hole 2.7: 1(0,0)
Pad_e17
  round 4.5 hole 2.7: 1(0,0)
Pad_e18
  round 4.5 hole 2.7: 1(0,0)
Pad_e19
  round 4.5 hole 2.7: 1(0,0)
R0603
  rect 0.806x0.864 smd: 1(-0.753,0) 2(0.753,0)
SOT-23-3_L2.9-W1.3-P1.90-LS2.4-BR
  rect 1.25x0.7 smd: 1(1,-0.95) 2(1,0.95) 3(-1,0)
SW-TH_SHOU-HAN_SS12D10G4
  oval 1.7x2.9 hole 1.1x2.3: 1(-4.8,0) 2(0,0) 3(4.8,0)
VQFN-HR-15_L3.0-W2.5-P0.50-BL_TPS63070RNMR
  rect 0.25x0.7 smd: 1(-0.75,-1.016) 2(-0.25,-1.016) 3(0.25,-1.016) 4(0.75,-1.016)
  rect 0.7x0.25 smd: 5(1.45,-0.566) 6(1.45,-0.066) 7(1.45,0.434) 8(1.45,0.934) 12(-1.45,0.434) 13(-1.45,0.934) 14(-1.45,-0.066) 15(-1.45,-0.566)
  rect 0.25x1.45 smd: 9(0.5,1.016) 11(-0.5,1.016)
  rect 0.25x1.85 smd: 10(0,0.817)

## Nets
As in the schematic.

Pads without a net: ARDUCAM_CARD 4 8 9 10 13 14 15 16 17 18 19 20 21 22 23 24 25 26; NOREF 1; NOREF#2 1; NOREF#3 1; NOREF#4 1; S42C_ARM 5; S42C_CR 5

## Via types
v1: diameter 0.61, hole 0.305, Top Layer to Bottom Layer, 1 via

## Routing (per net, layer and track width the routed paths; a pad name or vN(x,y) marks a point on that pad's centre or on a via; arc(x,y) is an arc through that point)
3.3V: length 154.3
  Top Layer w0.254: 5.78,24.75 7.38,24.75 8.38,23.74 10.41,23.74 11.18,24.5 11.18,28.31 12.7,29.84 15.12,29.84 U1.3 ; U2.3 15.64,44.32 13.08,44.32 10.92,42.16 10.92,37.01 ; CR_ON.1 37.56,34.38 37.08,33.9 13.21,33.9 10.92,36.19 10.92,37.01 ; 5.78,37.01 10.92,37.01 ; ARM_ON.1 36.7,21.58 35.53,20.41 5.78,20.41
  Top Layer w0.508: RPI_CONNECTOR.1 5.78,48.64 C12.1 5.78,4.98 8.38,2.37 ARDUCAM_CARD.1
12V: length 145.7
  Top Layer w0.813: 40.26,11.68 37.72,11.68 37.21,11.17 37.21,9.51 ; 37.21,9.51 34.85,9.51 C3.2 C4.2 C5.2 34.35,16.44 37.03,19.12 45.67,19.12 46.23,19.68 59.41,19.68 12V_OUT.1 ; 37.21,9.51 R5.1
  Top Layer w2.032: C2.1 27,42.23 28.32,43.55 44.58,43.55 45.97,42.16 45.97,39.83 S42C_CR.6 ; C1.1 28.4,27 30.61,29.2 43.18,29.2 46.03,26.36 S42C_ARM.6 49.52,29.27 60,29.27 ; 12V_OUT.1 62.23,22.5 62.23,27.3 62.02,27.51 62.02,27.57 60.31,29.27 12V_PWR.1
  Bottom Layer w0.508: 60,29.27 59.06,30.22 59.06,43.33 AMBIENT_LED.2
  Bottom Layer w2.032: S42C_CR.6 S42C_ARM.6
+5V: length 55.9
  Top Layer w0.61: C13.1 9.08,5.47 ARDUCAM_CARD.2
  Bottom Layer w0.61: RPI_CONNECTOR.2 6.15,51.55 6.15,7 ARDUCAM_CARD.2
GND: length 103.5
  Top Layer w0.254: 42.04,10.95 42.06,10.93 42.76,10.93 ; U3.6 42.76,10.93 ; 42.76,10.93 42.75,10.92 U3.4 42.75,8.68 43.72,7.7 C10.1
  Top Layer w0.508: S42C_CR.4 42.2,38.6
  Bottom Layer w0.254: RPI_CONNECTOR.25 38.85,41.96 S42C_CR.4 ; RPI_CONNECTOR.9 17.26,52.5 14.72,52.5 RPI_CONNECTOR.6
  Bottom Layer w1.016: C1.2 24.26,27.74 24.26,39.26 C2.2 ; 51.94,13.11 51.65,12.82 44.01,12.82 v1(42,10.81) ; 51.94,13.11 5V_OUT.2 ; 51.94,13.11 56.56,17.73 ; 56.63,26.78 56.63,17.8 56.56,17.73 ; 56.63,26.78 RPI_CONNECTOR.39 ; 56.63,26.78 56.68,26.73 12V_PWR.2 ; 56.56,17.73 12V_OUT.2
DIR_ARM: length 45.2
  Bottom Layer w0.254: RPI_CONNECTOR.37 54.09,30.46 47.12,23.49 36.82,23.49 34.53,25.78 S42C_ARM.1
DIR_CR: length 31.5
  Bottom Layer w0.254: S42C_CR.1 34.53,39.78 35.84,38.47 41.29,38.47 42.28,39.46 42.28,45.08 47.75,50.55 47.75,51.81 48.39,52.44 52.76,52.44 RPI_CONNECTOR.38
EN_ARM: length 36.6
  Top Layer w0.254: U1.2 14.28,25.08 17.02,22.34 27.39,22.34 27.9,22.85 35.6,22.85 36.71,23.96 38.53,23.96 ; 45.53,21.78 43.95,23.36 39.13,23.36 38.53,23.96 ; 38.53,23.96 38.53,25.78
EN_CR: length 36.9
  Top Layer w0.254: R3.1 44.61,36.7 41.61,36.7 S42C_CR.3 38.48,39.73 38.48,38.35 37.72,37.58 31.88,37.58 30.73,36.44 18.71,36.44 U2.2
GPIO4(GPCLK0): length 50.1
  Bottom Layer w0.254: ARDUCAM_CARD.7 17.27,3.5 17.27,38.86 15.99,40.14 RPI_CONNECTOR.7
GPIO5: length 20.1
  Top Layer w0.254: RPI_CONNECTOR.29 45.38,49.78 49.28,49.78 50.29,50.79 50.29,51.81 51.05,52.57 51.94,52.57 52.71,51.81 52.71,45.72 R1.1 53.56,45.68 53.85,45.97 54.98,45.97 Q3.1
GPIO12(PWM0): length 22.6
  Bottom Layer w0.254: S42C_CR.2 37.59,41.34 37.59,51.94 38.1,52.44 45.47,52.44 46.47,53.45 RPI_CONNECTOR.32
GPIO13(PWM1): length 30.8
  Bottom Layer w0.254: RPI_CONNECTOR.33 49.01,49.38 44.58,44.95 44.58,34.33 S42C_ARM.2
GPIO16: length 49.2
  Top Layer w0.254: RPI_CONNECTOR.36 50.22,52.44 43.53,52.44 42.66,51.57 42.66,50.81 39.72,47.87 14.1,47.87 9.48,43.25 U2.1
GPIO17: length 50
  Bottom Layer w0.254: ARDUCAM_CARD.11 19.81,3.5 19.81,14.29 21.07,15.55 RPI_CONNECTOR.11
GPIO18(PCM_CLK): length 50.1
  Bottom Layer w0.254: RPI_CONNECTOR.12 22.35,52.49 22.35,8.63 21.08,7.36 ARDUCAM_CARD.12
GPIO19: length 63
  Top Layer w0.254: U1.1 9.48,29.67 13.21,33.39 47.75,33.39 51.55,37.19 RPI_CONNECTOR.35
GPIO23: length 67.5
  Bottom Layer w0.254: RPI_CONNECTOR.16 24.93,54.99 12.58,54.99 12.18,54.59 12.18,3.49 ARDUCAM_CARD.3
GPIO24: length 64.6
  Bottom Layer w0.254: RPI_CONNECTOR.18 27.42,52.5 27.42,43.38 26,41.97 26,9.1 22.35,5.45 22.35,1.9 22.26,1.8 22.26,1.74 21.57,1.05 21.51,1.05 21.09,0.63 15.06,0.63 ARDUCAM_CARD.5
$2N1921: length 5.6
  Top Layer w0.508: AMBIENT_LED.1 60.94,42.67 59.31,42.67 58.42,43.55 58.42,44.57 57.99,45 Q3.3
$2N9546: length 12
  Top Layer w0.254: R6.2 46.99,8.37 5V_PG.1 46.83,5.58 42.29,5.58 41.75,6.12 U3.2
$2N9638: length 29.1
  Top Layer w0.254: 43.7,11.47 43.78,11.47 44.08,11.17 44.08,10.91 ; R6.1 45.47,10.61 C11.2 45.53,10.91 44.08,10.91 ; U3.5 43.82,10.43 44.08,10.69 44.08,10.91
  Top Layer w0.813: 43.75,11.74 43.75,11.74 45.47,13.45 45.47,16 46.74,17.27 52.83,17.27 53.34,16.76 53.34,15.52 C8.2 C7.2 C6.2 53.34,10.46 53.34,8.76 54.44,7.65 5V_OUT.1
$2N9881: length 6.4
  Top Layer w0.254: C9.1 38.73,7.65 R5.2 38.74,9.51 38.74,10.41 39.26,10.93 U3.14 41,10.93 41.25,10.69 U3.1
$2N10294: length 3.7
  Top Layer w0.254: C10.2 42.63,8.16 42.25,8.54 U3.3
$2N13933: length 10.3
  Top Layer w0.254: 44.02,21.78 43.83,21.58 ARM_ON.2 38.64,22.73 36.58,22.73 35.43,21.58 ARM_OFF.1
$2N14161: length 11.8
  Top Layer w0.254: R3.2 43.93,35.68 CR_ON.2 39.62,35.71 39.62,36.82 39.37,37.08 35.09,37.08 34.71,36.7 CR_OFF.1

## Copper pours and planes (outline as drawn; the poured copper is in the pictures)
GND on Top Layer: -5.73,62.58 73.03,62.58 73.03,-10.42 -5.73,-10.42
GND on Bottom Layer: 36.15,17.62 36.17,17.8 36.23,17.99 36.32,18.17 36.45,18.33 36.6,18.46 36.78,18.55 36.98,18.61 37.15,18.62 46.75,18.62 46.93,18.61 47.12,18.55 47.3,18.46 47.46,18.33 47.59,18.17 47.68,17.99 47.74,17.8 47.75,17.62 47.75,7.47 47.74,7.29 47.68,7.1 47.59,6.92 47.46,6.76 47.3,6.64 47.12,6.54 46.93,6.49 46.75,6.47 37.15,6.47 36.98,6.49 36.78,6.54 36.6,6.64 36.45,6.76 36.32,6.92 36.23,7.1 36.17,7.29 36.15,7.47
$2N9076 on Top Layer: 40.27,14.76 41.62,14.76 41.62,12.02 40.27,12.02
$2N9079 on Top Layer: 42.38,14.57 43.67,14.57 43.67,12.02 42.38,12.02
$2N9638 on Top Layer: 43.1,12.06 44.52,12.06 44.52,11.31 43.1,11.31

Small or netless copper shapes (teardrops, artwork), in the pictures only: 4 on Top Layer

## Text on the board
Top Silkscreen Layer: CAROUSEL | ARM | + | - | Remote Labs / Atomic Spectra V0.2
